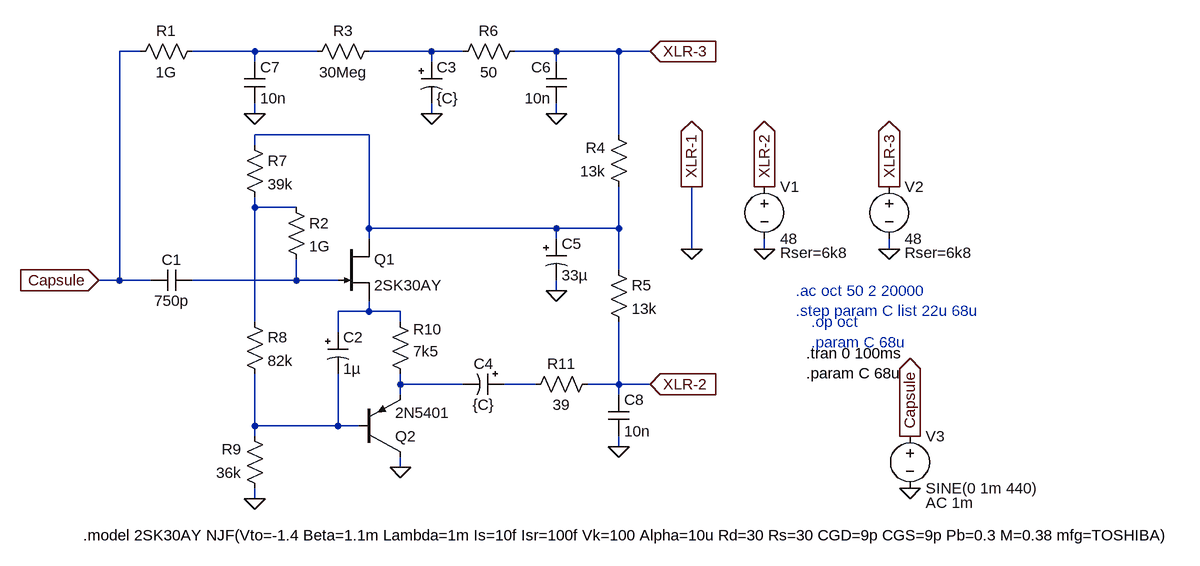
[diagram p0: schematic Oktava MK-12.asc]
Oktava MK-12.asc, the LTspice schematic file:
Version 4
SHEET 1 1928 744
WIRE 336 -16 304 -16
WIRE 512 -16 416 -16
WIRE 608 -16 512 -16
WIRE 784 -16 688 -16
WIRE 832 -16 784 -16
WIRE 976 -16 912 -16
WIRE 1072 -16 976 -16
WIRE 1120 -16 1072 -16
WIRE 512 0 512 -16
WIRE 784 0 784 -16
WIRE 976 0 976 -16
WIRE 512 80 512 64
WIRE 784 80 784 64
WIRE 976 80 976 64
WIRE 688 112 512 112
WIRE 1072 112 1072 -16
WIRE 512 128 512 112
WIRE 512 224 512 208
WIRE 576 224 512 224
WIRE 688 256 688 112
WIRE 976 256 688 256
WIRE 1072 256 1072 192
WIRE 1072 256 976 256
WIRE 688 272 688 256
WIRE 976 272 976 256
WIRE 1184 288 1184 192
WIRE 1296 288 1296 272
WIRE 1488 288 1488 272
WIRE 1072 320 1072 256
WIRE 304 336 304 -16
WIRE 304 336 272 336
WIRE 352 336 304 336
WIRE 576 336 576 304
WIRE 576 336 416 336
WIRE 640 336 576 336
WIRE 976 352 976 336
WIRE 688 384 688 368
WIRE 688 384 640 384
WIRE 736 384 688 384
WIRE 512 400 512 224
WIRE 736 400 736 384
WIRE 640 416 640 384
WIRE 736 496 736 480
WIRE 832 496 736 496
WIRE 944 496 896 496
WIRE 1072 496 1072 400
WIRE 1072 496 1024 496
WIRE 1120 496 1072 496
WIRE 736 512 736 496
WIRE 1072 512 1072 496
WIRE 512 560 512 480
WIRE 640 560 640 480
WIRE 640 560 512 560
WIRE 672 560 640 560
WIRE 512 576 512 560
WIRE 1072 592 1072 576
WIRE 736 624 736 608
WIRE 512 672 512 656
FLAG 976 80 0
FLAG 784 80 0
FLAG 512 80 0
FLAG 1120 -16 XLR-3
IOPIN 1120 -16 In
FLAG 1296 288 0
FLAG 1488 288 0
FLAG 1488 192 XLR-3
IOPIN 1488 192 Out
FLAG 1296 192 XLR-2
IOPIN 1296 192 Out
FLAG 1184 288 0
FLAG 1184 192 XLR-1
IOPIN 1184 192 Out
FLAG 272 336 Capsule
IOPIN 272 336 In
FLAG 976 352 0
FLAG 736 624 0
FLAG 1120 496 XLR-2
IOPIN 1120 496 In
FLAG 512 672 0
FLAG 1072 592 0
FLAG 1520 656 0
FLAG 1520 576 Capsule
IOPIN 1520 576 Out
SYMBOL Res 1056 304 R0
SYMATTR InstName R5
SYMATTR Value 13k
SYMBOL njf 640 272 R0
SYMATTR InstName Q1
SYMATTR Value 2SK30AY
SYMBOL pnp 672 608 M180
SYMATTR InstName Q2
SYMATTR Value 2N5401
SYMBOL Res 928 -32 R90
WINDOW 0 0 56 VBottom 2
WINDOW 3 32 56 VTop 2
SYMATTR InstName R6
SYMATTR Value 50
SYMBOL Res 752 496 R180
WINDOW 0 -48 85 Left 2
WINDOW 3 -43 51 Left 2
SYMATTR InstName R10
SYMATTR Value 7k5
SYMBOL Res 704 -32 R90
WINDOW 0 0 56 VBottom 2
WINDOW 3 32 56 VTop 2
SYMATTR InstName R3
SYMATTR Value 30Meg
SYMBOL Res 320 0 R270
WINDOW 0 32 56 VTop 2
WINDOW 3 0 56 VBottom 2
SYMATTR InstName R1
SYMATTR Value 1G
SYMBOL Res 1088 208 R180
WINDOW 0 36 76 Left 2
WINDOW 3 36 40 Left 2
SYMATTR InstName R4
SYMATTR Value 13k
SYMBOL Res 928 512 R270
WINDOW 0 32 56 VTop 2
WINDOW 3 0 56 VBottom 2
SYMATTR InstName R11
SYMATTR Value 39
SYMBOL Res 528 672 R180
WINDOW 0 36 76 Left 2
WINDOW 3 36 40 Left 2
SYMATTR InstName R9
SYMATTR Value 36k
SYMBOL Cap 416 320 R90
WINDOW 0 0 32 VBottom 2
WINDOW 3 32 32 VTop 2
SYMATTR InstName C1
SYMATTR Value 750p
SYMBOL Cap 496 0 R0
SYMATTR InstName C7
SYMATTR Value 10n
SYMBOL Cap 992 64 R180
WINDOW 0 24 56 Left 2
WINDOW 3 24 8 Left 2
SYMATTR InstName C6
SYMATTR Value 10n
SYMBOL polcap 960 272 R0
SYMATTR InstName C5
SYMATTR Value 33µ
SYMBOL polcap 768 0 R0
SYMATTR InstName C3
SYMATTR Value {C}
SYMBOL polcap 624 416 R0
SYMATTR InstName C2
SYMATTR Value 1µ
SYMBOL Voltage 1296 176 R0
WINDOW 39 24 118 Left 2
SYMATTR SpiceLine Rser=6k8
SYMATTR InstName V1
SYMATTR Value 48
SYMBOL Voltage 1488 176 R0
WINDOW 39 24 118 Left 2
SYMATTR SpiceLine Rser=6k8
SYMATTR InstName V2
SYMATTR Value 48
SYMBOL polcap 896 480 R90
WINDOW 0 0 32 VBottom 2
WINDOW 3 32 32 VTop 2
SYMATTR InstName C4
SYMATTR Value {C}
SYMBOL Res 496 384 R0
SYMATTR InstName R8
SYMATTR Value 82k
SYMBOL Res 496 112 R0
SYMATTR InstName R7
SYMATTR Value 39k
SYMBOL Res 560 208 R0
SYMATTR InstName R2
SYMATTR Value 1G
SYMBOL Cap 1056 512 R0
SYMATTR InstName C8
SYMATTR Value 10n
SYMBOL Voltage 1520 560 R0
WINDOW 123 24 118 Left 2
SYMATTR Value2 AC 1m
SYMATTR InstName V3
SYMATTR Value SINE(0 1m 440)
TEXT 1368 400 Left 2 ;.op oct\n.param C 68u
TEXT 1360 448 Left 2 !.tran 0 100ms\n.param C 68u
TEXT 1344 352 Left 2 ;.ac oct 50 2 20000\n.step param C list 22u 68u
TEXT 248 728 Left 2 !.model 2SK30AY NJF(Vto=-1.4 Beta=1.1m Lambda=1m Is=10f Isr=100f Vk=100 Alpha=10u Rd=30 Rs=30 CGD=9p CGS=9p Pb=0.3 M=0.38 mfg=TOSHIBA)

The netlist it stands for:
* Oktava MK-12.asc
R5 N003 XLR-2 13k
J§Q1 N003 N005 N006 2SK30AY
Q2 0 N009 N007 0 2N5401
R6 XLR-3 N002 50
R10 N007 N006 7k5
R3 N002 N001 30Meg
R1 Capsule N001 1G
R4 N003 XLR-3 13k
R11 N008 XLR-2 39
R9 0 N009 36k
C1 N005 Capsule 750p
C7 N001 0 10n
C6 0 XLR-3 10n
C5 N003 0 33µ
C3 N002 0 {C}
C2 N006 N009 1µ
V1 XLR-2 0 48 Rser=6k8
V2 XLR-3 0 48 Rser=6k8
C4 N008 N007 {C}
R8 N004 N009 82k
R7 N003 N004 39k
R2 N004 N005 1G
C8 XLR-2 0 10n
V3 Capsule 0 SINE(0 1m 440) AC 1m
.model NPN NPN
.model PNP PNP
.lib standard.bjt
.model NJF NJF
.model PJF PJF
.lib standard.jft
* .op oct
* .param C 68u
.tran 0 100ms
.param C 68u
* .ac oct 50 2 20000
* .step param C list 22u 68u
.model 2SK30AY NJF(Vto=-1.4 Beta=1.1m Lambda=1m Is=10f Isr=100f Vk=100 Alpha=10u Rd=30 Rs=30 CGD=9p CGS=9p Pb=0.3 M=0.38 mfg=TOSHIBA)
.backanno
.end